# EAGLE design hacker-boards-refactor (EAGLE 7.3.0)
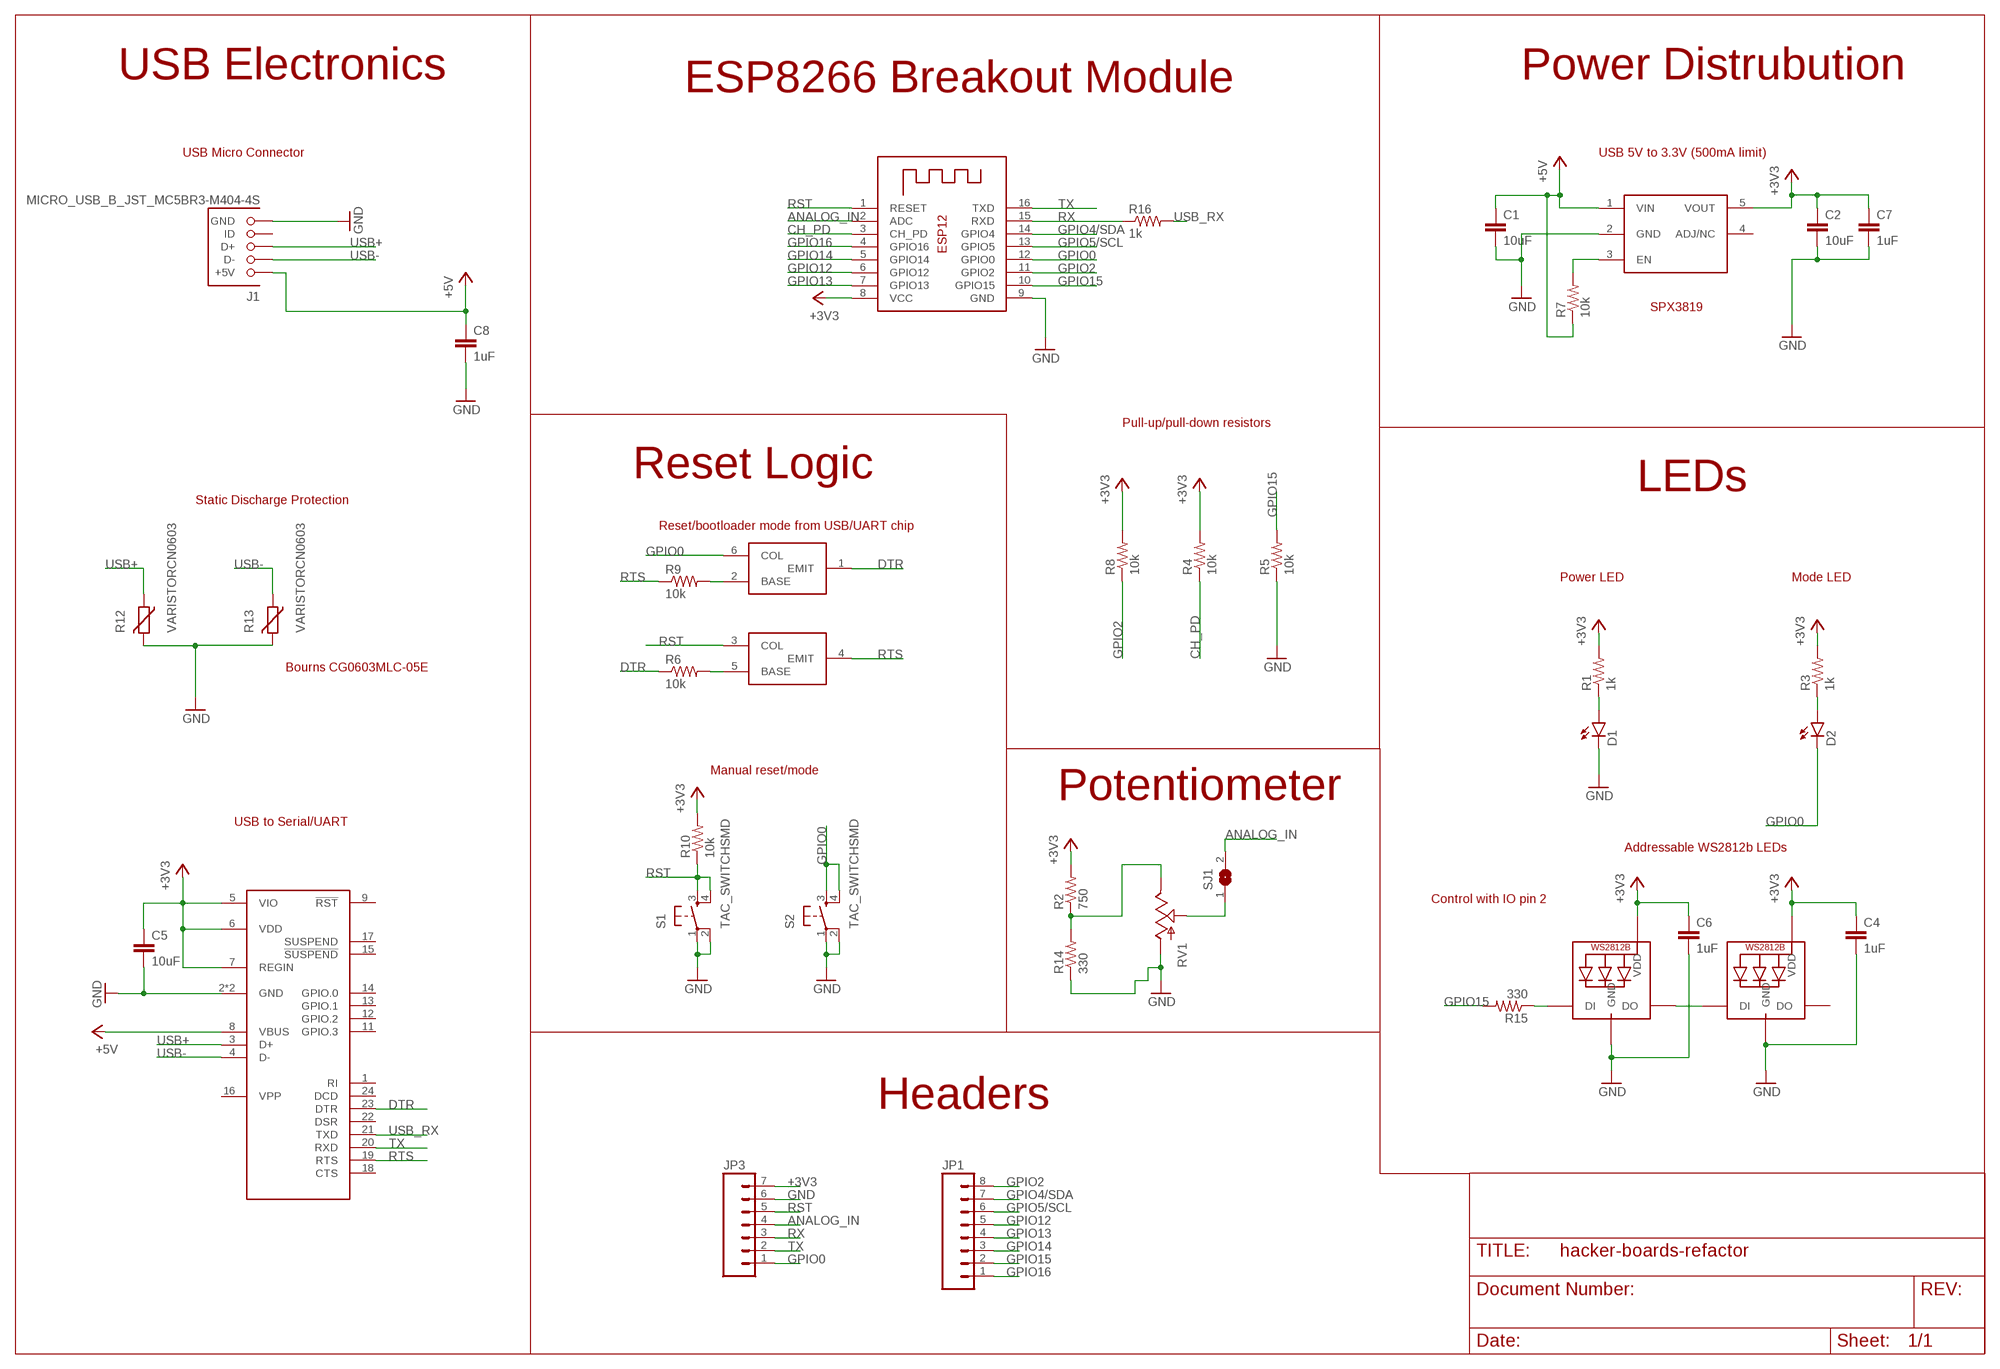
[diagram p0: schematic, sheet 1]

## Parts
C1  10uF  C0805  [C0805]
C2  10uF  C0805  [C0805]
C4  1uF  C-EUC0402  [C0402]
C5  10uF  C0805  [C0805]
C6  1uF  C-EUC0402  [C0402]
C7  1uF  C-EUC0402  [C0402]
C8  1uF  C-EUC0402  [C0402]
D1  LED0603  [LED-0603]
D2  LED0603  [LED-0603]
J1  MICRO_USB_B_JST_MC5BR3-M404-4S  [USB_MICRO_B-JST-MC5BR3-M404-4S-TB]
JP1  M08  [1X08_ROUND]
JP3  M07  [1X07]
LED1  WS2812B5050  [WS2812B]
LED2  WS2812B5050  [WS2812B]
R1  1k  R-US_R0402  [R0402]
R2  750  R-US_R0402  [R0402]
R3  1k  R-US_R0402  [R0402]
R4  10k  R-US_R0402  [R0402]
R5  10k  R-US_R0402  [R0402]
R6  10k  R-US_R0402  [R0402]
R7  10k  R-US_R0402  [R0402]
R8  10k  R-US_R0402  [R0402]
R9  10k  R-US_R0402  [R0402]
R10  10k  R-US_R0402  [R0402]
R12  VARISTORCN0603  [CT/CN0603]
R13  VARISTORCN0603  [CT/CN0603]
R14  330  R-US_R0402  [R0402]
R15  330  R-US_R0402  [R0402]
R16  1k  R-US_R0402  [R0402]
RV1  POTALPS-KIT  [ALPS_POT_KIT]
S1  TAC_SWITCHSMD  [TACTILE-SWITCH-SMD]
S2  TAC_SWITCHSMD  [TACTILE-SWITCH-SMD]
SJ1  SJ  [SJ]
U$2  AP2112  [SOT23-5L]
U$3  CP2104  [QFN24_4X4]
U$4  MBT3904DW1T1G  [SOT363]
X1  ESP-12  [ESP-12]

## Nets
+3V3: C2.1 C4.1 C5.1 C6.1 C7.1 JP3.7 LED1.1-VDD(VDD) LED2.1-VDD(VDD) R1.2 R2.2 R3.2 R4.2 R8.2 R10.2 U$2.5(VOUT) U$3.5(VIO) U$3.6(VDD) U$3.7(REGIN) X1.8(VCC)
+5V: C1.1 C8.1 J1.1(+5V) R7.1 U$2.1(VIN) U$3.8(VBUS)
ANALOG_IN: JP3.4 SJ1.2 X1.2(ADC)
CH_PD: R4.1 X1.3(CH_PD)
DTR: R6.1 U$3.23(DTR) U$4.1(EMIT)
GND: C1.2 C2.2 C4.2 C5.2 C6.2 C7.2 C8.2 D1.C J1.5(GND) JP3.6 LED1.3-GND(GND) LED2.3-GND(GND) R5.1 R12.2 R13.2 R14.1 RV1.P$3(A) S1.1 S1.2 S2.1 S2.2 U$2.2(GND) U$3.2(GND) U$3.25(GND) X1.9(GND)
GPIO0: D2.C JP3.1 S2.3 S2.4 U$4.6(COL) X1.12(GPIO0)
GPIO2: JP1.8 R8.1 X1.11(GPIO2)
GPIO4/SDA: JP1.7 X1.14(GPIO4)
GPIO5/SCL: JP1.6 X1.13(GPIO5)
GPIO12: JP1.5 X1.6(GPIO12)
GPIO13: JP1.4 X1.7(GPIO13)
GPIO14: JP1.3 X1.5(GPIO14)
GPIO15: JP1.2 R5.2 R15.2 X1.10(GPIO15)
GPIO16: JP1.1 X1.4(GPIO16)
N$1: D1.A R1.1
N$3: D2.A R3.1
N$4: R2.1 R14.2 RV1.P$1(E)
N$5: LED1.2-DOUT(DO) LED2.4-DIN(DI)
N$6: LED1.4-DIN(DI) R15.1
N$7: R7.2 U$2.3(EN)
N$8: R9.2 U$4.2(BASE)
N$11: R6.2 U$4.5(BASE)
N$12: RV1.P$2(S) SJ1.1
RST: JP3.5 R10.1 S1.3 S1.4 U$4.3(COL) X1.1(RESET)
RTS: R9.1 U$3.19(RTS) U$4.4(EMIT)
RX: JP3.3 R16.1 X1.15(RXD)
TX: JP3.2 U$3.20(RXD) X1.16(TXD)
USB+: J1.3(D+) R12.1 U$3.3(D+)
USB-: J1.2(D-) R13.1 U$3.4(D-)
USB_RX: R16.2 U$3.21(TXD)
Unconnected: J1.4(ID) LED2.2-DOUT(DO) U$2.4(ADJ/NC) U$3.1(RI) U$3.9(!RST) U$3.11(GPIO.3) U$3.12(GPIO.2) U$3.13(GPIO.1) U$3.14(GPIO.0) U$3.15(!SUSPEND) U$3.16(VPP) U$3.17(SUSPEND) U$3.18(CTS) U$3.22(DSR) U$3.24(DCD)

## Notes on the sheet
- USB Electronics | Power Distrubution
- ESP8266 Breakout Module
- USB Micro Connector | USB 5V to 3.3V (500mA limit)
- SPX3819
- Pull-up/pull-down resistors
- Reset Logic
- LEDs
- Static Discharge Protection
- Reset/bootloader mode from USB/UART chip
- Power LED | Mode LED
- Bourns CG0603MLC-05E
- Manual reset/mode
- Potentiometer
- USB to Serial/UART
- Addressable WS2812b LEDs
- Control with IO pin 2
- Headers

## Library data of the parts
C1 C2 C5 = hacker-board:C
C4 C6-C8 = resistor:C-EU: CAPACITOR, European symbol
D1 D2 = hacker-board:LED: LEDs Standard schematic elements and footprints for 5mm, 3mm, 1206, and 0603 sized LEDs. 5mm - Spark Fun Electronics SKU : COM-00529 (and others)
J1 = hacker-board:MICRO_USB_B_JST_MC5BR3-M404-4S: Micro USB B mid mount; DIGIKEY: 455-2567-2-ND; MOUSER: 53X3655
JP1 = SparkFun-Connectors:M08: Header 8 Standard 8-pin 0.1" header. Use with straight break away headers (SKU : PRT-00116), right angle break away headers (PRT-00553), swiss pins (PRT-00743), machine pins (PRT-00117), and female headers (PRT-00115).; PROD_ID: CONN-08437
JP3 = SparkFun-Connectors:M07: Header 7 Standard 7-pin 0.1" header. Use with straight break away headers (SKU : PRT-00116), right angle break away headers (PRT-00553), swiss pins (PRT-00743), machine pins (PRT-00117), and female headers (PRT-00115). NOTES ON THE VARIANTS LOCK and LOCK_LONGPADS... This footprint was designed to help hold the alignment of a through-hole component (i.e. 7-pin header) while soldering it into place. You may notice that each hole has been shifted either up or down by 0.005 of an inch from it's more standard position (which is usually a perfectly straight line). This slight alteration caused the pins (the squares in the middle) to touch the edges of the holes. Because they are alternating, it causes a "brace" to hold the header in place. 0.005 has proven to be the perfect amount of "off-center" position when using our standard breakaway headers. Although looks a little odd when you look at the bare footprint, once you have a header in there, the alteration is very hard to notice. Also, if you push a header all the way into place, it is covered up entirely on the bottom side. This idea of altering the position of holes to aid alignment will be further integrated into the Sparkfun Library for other footprints. It can help hold any component with 3 or more connection pins.
LED1 LED2 = hacker-board:WS2812B
R1-R10 R14-R16 = resistor:R-US_: RESISTOR, American symbol
R12 R13 = varistor:VARISTOR: VARISTOR
RV1 = SparkFun-Electromechanical:POT; PROD_ID: RES-09177
S1 S2 = hacker-board:TAC_SWITCH: Momentary Switch Button commonly used for reset or general input. Spark Fun Electronics SKU : COM-00097 SMT- SWCH-08247; PROD_ID: SWCH-08247
SJ1 = jumper:SJ: SMD solder JUMPER
U$2 = hacker-board:AP2112
U$3 = hacker-board:CP2104
U$4 = hacker-board:MBT3904DW1T1G
X1 = hacker-board:ESP-12

## Net classes
0 default: width 0.203 mm, drill 0.406 mm

## Board
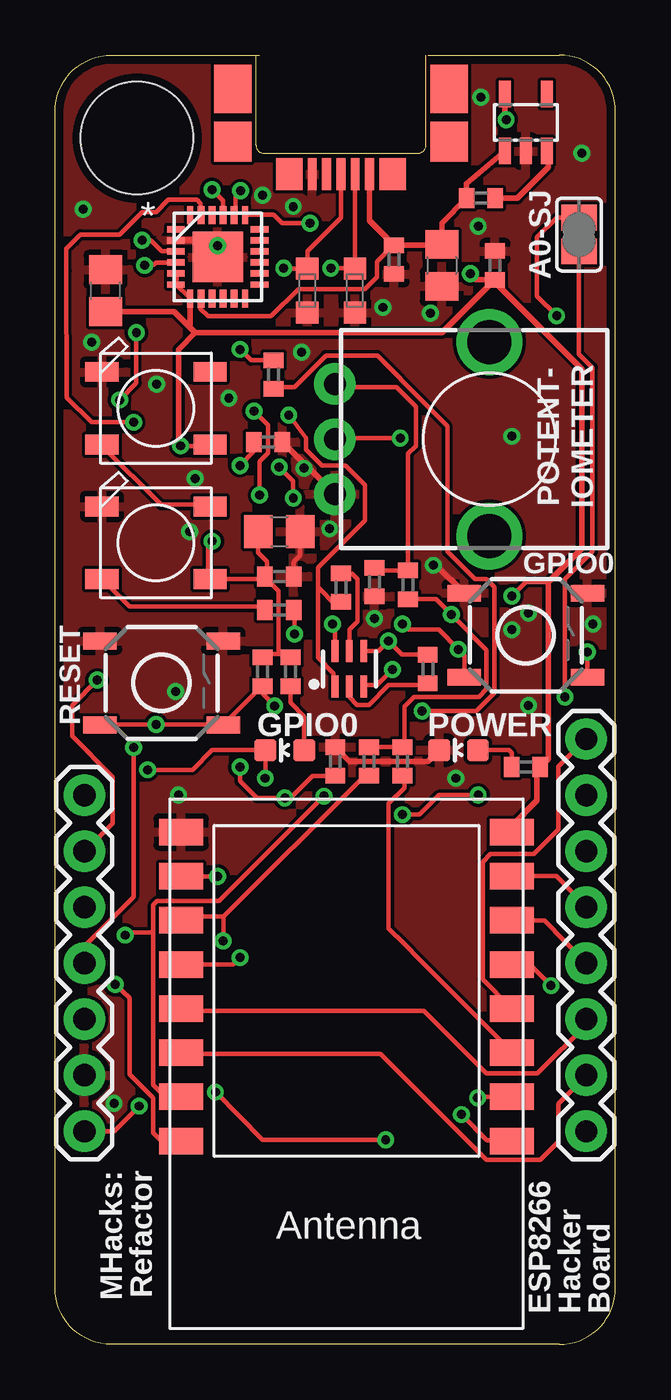
[diagram p1: board, top side]
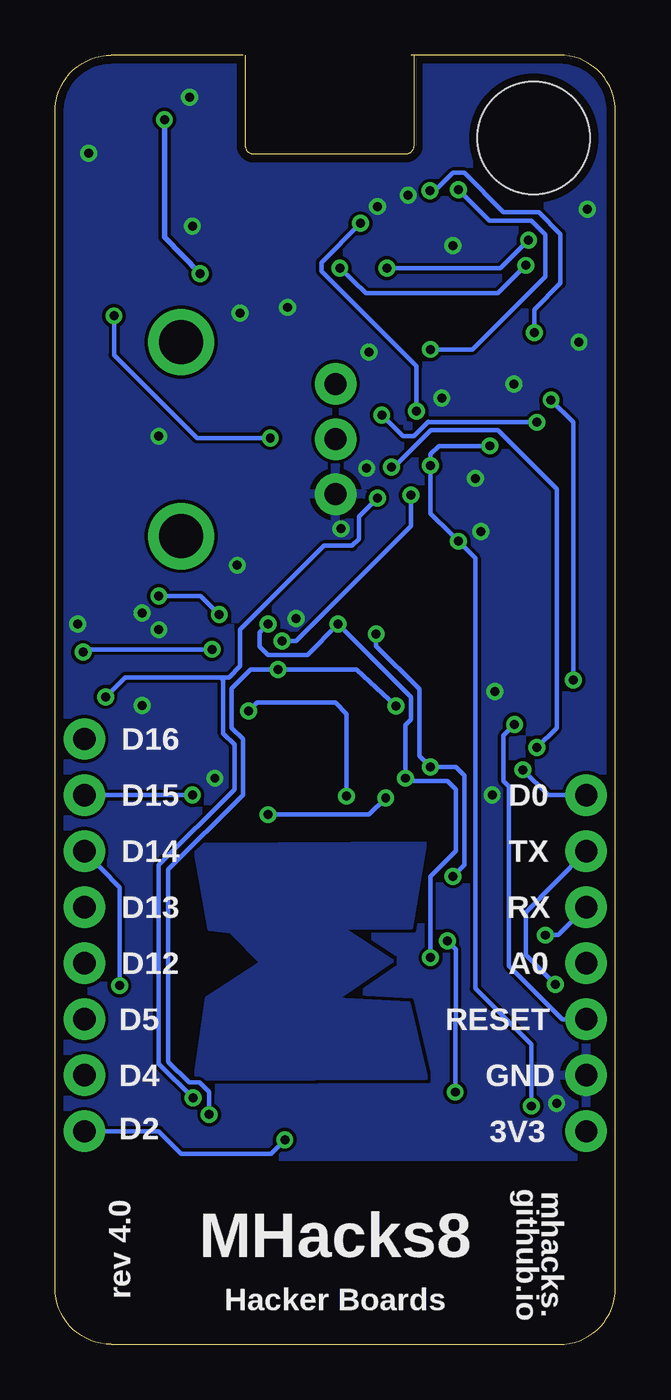
[diagram p2: board, bottom side, seen from below]

Size 25.4 x 58.42 mm. Coordinates in mm from the lower left corner, seen from the top.
Outline: 9.27,58.42 2.54,58.42 arc90 0,55.88 0,2.54 arc90 2.54,0 22.86,0 arc90 25.4,2.54 25.4,55.88 arc90 22.86,58.42 16.89,58.42
Copper layers (1*16): Top 0.0356mm / dielectric 1.5011mm / Bottom 0.0356mm
Design rules "LaenPCBOrder": minimum track width 6mil, minimum drill 13mil, track to track 6mil, track to pad 6mil, pad to pad 6mil, via to via 6mil, smd to smd 6mil, copper to edge 15mil, drill to drill 6mil, minimum pad ring 7mil, minimum via ring 7mil, stop-mask expansion 3mil, vias tented up to drill 0mil, thermal gap 10mil
Holes 5.08 mm at 3.71,54.66

### Footprints (pad centres in the part's own frame; a part is rotated, then mirrored left to right if it is on the bottom)
C0805 = smd 1.3 x 1.5: 1 -0.95,0; 2 0.95,0
C0402 = smd 0.7 x 0.9: 1 -0.65,0; 2 0.65,0
LED-0603 = smd 1 x 1: A 0,-0.877; C 0,0.877
USB_MICRO_B-JST-MC5BR3-M404-4S-TB = smd 0.4 x 1.45: 1 -1.3,3.875; 2 -0.65,3.875; 3 0,3.875; 4 0.65,3.875; 5 1.3,3.875 | smd 1.7 x 2.2: P$1 -4.9,0; P$2 4.9,0 | smd 1.7 x 1.8: P$3 -4.9,2.4; P$4 4.9,2.4 | smd 1.2 x 1.45: P$5 -2.35,3.875; P$6 2.35,3.875
1X08_ROUND = drill 1.016 pad 1.88: 1 0,0; 2 2.54,0; 3 5.08,0; 4 7.62,0; 5 10.16,0; 6 12.7,0; 7 15.24,0; 8 17.78,0
1X07 = drill 1.016 pad 1.88: 1 0,0; 2 2.54,0; 3 5.08,0; 4 7.62,0; 5 10.16,0; 6 12.7,0; 7 15.24,0
WS2812B = smd 1.5 x 0.9: 1-VDD 2.45,-1.65; 2-DOUT 2.45,1.65; 3-GND -2.45,1.65; 4-DIN -2.45,-1.65
R0402 = smd 0.7 x 0.9: 1 -0.65,0; 2 0.65,0
CT/CN0603 = smd 1 x 1: 1 -1,0; 2 1,0
ALPS_POT_KIT = drill 1 pad 1.88: P$1 7,-2.5; P$2 7,0; P$3 7,2.5 | drill 2: P$4 0,-4.4; P$5 0,4.4
TACTILE-SWITCH-SMD = smd 1.524 x 0.762: 1 -2.794,1.905; 2 2.794,1.905; 3 -2.794,-1.905; 4 2.794,-1.905
SJ = smd 1.168 x 1.6: 1 -0.762,0; 2 0.762,0
SOT23-5L = smd 0.55 x 1.2: 1 -0.95,-1.3; 2 0,-1.3; 3 0.95,-1.3; 4 0.95,1.3; 5 -0.95,1.3
QFN24_4X4 = smd 0.813 x 0.279: 1 -1.892,1.25; 6 -1.892,-1.25; 13 1.892,-1.25; 18 1.892,1.25 | smd 0.813 x 0.305: 2 -1.892,0.75; 3 -1.892,0.25; 4 -1.892,-0.25; 5 -1.892,-0.75; 14 1.892,-0.75; 15 1.892,-0.25; 16 1.892,0.25; 17 1.892,0.75 | smd 0.279 x 0.813: 7 -1.25,-1.892; 12 1.25,-1.892; 19 1.25,1.892; 24 -1.25,1.892 | smd 0.305 x 0.813: 8 -0.75,-1.892; 9 -0.25,-1.892; 10 0.25,-1.892; 11 0.75,-1.892; 20 0.75,1.892; 21 0.25,1.892; 22 -0.25,1.892; 23 -0.75,1.892 | smd 2.286 x 2.286: 25 0,0
SOT363 = smd 0.3 x 0.99: 1 -0.65,-0.8; 2 0,-0.8; 3 0.65,-0.8; 4 0.65,0.81; 5 0,0.81; 6 -0.65,0.81
ESP-12 = smd 2 x 1.2: 1 -7.5,4.5; 2 -7.5,2.5; 3 -7.5,0.5; 4 -7.5,-1.5; 5 -7.5,-3.5; 6 -7.5,-5.5; 7 -7.5,-7.5; 8 -7.5,-9.5; 9 7.5,-9.5; 10 7.5,-7.5; 11 7.5,-5.5; 12 7.5,-3.5; 13 7.5,-1.5; 14 7.5,0.5; 15 7.5,2.5; 16 7.5,4.5

### Placement (x,y rotation side)
C1  17.53,48.9 270 top
C2  10.16,36.83 0 top
C4  9.65,40.89 0 top
C5  2.29,47.75 90 top
C6  10.16,34.8 0 top
C7  19.94,48.9 90 top
C8  15.37,49.15 270 top
D1  18.29,26.92 90 top
D2  10.41,26.92 90 top
J1  12.95,56.9 180 top
JP1  24.08,27.43 270 top
JP3  1.32,24.89 270 top
LED1  4.57,36.32 0 top
LED2  4.57,42.42 0 top
R1  21.34,26.16 0 top
R2  16,34.42 270 top
R3  10.67,30.48 90 top
R4  15.75,26.42 90 top
R5  12.7,26.42 270 top
R6  12.95,34.29 90 top
R7  19.3,51.94 0 top
R8  14.22,26.42 90 top
R9  16.89,30.61 270 top
R10  9.4,30.48 90 top
R12  11.43,47.75 270 top
R13  13.59,47.75 270 top
R14  14.48,34.54 90 top
R15  10.16,33.27 0 top
R16  9.91,43.94 90 top
RV1  19.68,41.02 180 top
S1  4.83,29.97 0 top
S2  21.34,32.13 0 top
SJ1  23.75,50.29 270 top
U$1  [LOGO8EDGY]  8.69,12.09 90 bottom
U$2  21.34,55.37 0 top
U$3  7.37,49.28 0 top
U$4  13.34,30.61 0 top
X1  13.21,13.72 180 top

### Tracks (layer width: path | path; a pad name or v marks a point on that pad's centre or on a via)
+3V3  (via drill 0.41, 0.41 pad 0.41)
  Top 0.203: 5.51,48.01 5.51,48.54 U$3.5 | 5.51,48.01 6.04,47.47 U$3.7 | 5.51,48.01 U$3.6 | R4.2 15.82,27.2 15.82,28.91 16.26,29.34 19.2,29.34 19.56,29.69 19.56,31.47 v17.96,33.07 17.26,33.77 R2.2 | 20.62,23.47 X1.8 | 15.82,27.03 R4.2 | 10.13,31.29 10.67,31.29 R3.2 | 10.13,31.29 9.42,31.29 R10.2 | 9.07,40.89 C4.1 9,40.45 v8.38,39.83 | C6.1 9.6,34.85 9.6,35.48 9.21,35.88 C2.1 | 10.13,31.29 10.13,34.14 9.6,34.67 C6.1 | C6.1 9.42,34.67 7.11,34.67 LED1.1-VDD 6.93,34.85 6.93,36.21 v7.12,36.39 | v5.69,40.72 6.93,40.72 LED2.1-VDD | R8.2 R4.2 | 22.35,34.54 21.34,34.54 v20.7,33.91 | JP3.7 2.67,9.65 v3.81,10.79
  Top 0.254: C7.1 19.94,48.13 23.88,44.2 23.88,36.07 22.35,34.54 22.35,26.53 R1.2 21.84,26.02 21.84,24.64 20.71,23.5 X1.8 | 6.35,45.85 17.54,45.85 C7.1 | 6.12,46.08 U$3.7 | 6.35,45.85 5.59,45.09 5.59,40.82 v5.69,40.72 | 6.12,46.08 6.35,45.85 | U$2.5 20.39,55.69 v20.45,55.5 | v18.82,48.51 19.07,48.24 C7.1 | C5.1 5.39,46.8 6.12,46.08
  Bottom 0.203: v5.69,40.72 8,40.72 8.38,40.34 v8.38,39.83 8.38,37.66 7.51,36.79 v7.12,36.39 6.35,35.63 6.35,16.13 3.81,13.59 v3.81,10.79 | v20.7,33.91 18.8,33.91 v17.96,33.07
  Bottom 0.254: v20.45,55.5 20.45,50.16 v18.82,48.51
+5V
  Top 0.203: U$3.8 6.58,47.3 6.58,46.94 6.93,46.58 9.78,46.58 11.02,47.83 14.05,47.83 14.58,48.36 14.58,49.07 15.29,49.78 C8.1
  Top 0.254: U$2.1 18.65,52.59 R7.1 17.53,50.81 C1.1 17.48,49.8 C8.1 14.25,50.91 J1.1
ANALOG_IN  (via drill 0.41, 0.41 pad 0.41)
  Top 0.203: v23.11,29.34 23.11,34.67 24.36,35.92 24.36,44.27 23.75,44.88 SJ1.2 | v3.56,27.05 3.56,20.27 1.42,18.14 1.42,17.42 JP3.4 | v10.79,38.35 10.79,39.12 v10.16,39.75 | X1.2 19.14,11.22 v19.15,11.18
  Bottom 0.203: v10.79,38.35 11.63,37.52 11.63,36.5 11.94,36.2 13.21,36.2 17.02,32.38 17.02,30.73 17.53,30.23 17.91,30.23 | v10.16,39.75 10.03,39.75 8.36,41.43 5.33,41.43 2.67,38.76 2.67,27.94 v3.56,27.05 | v23.11,29.34 22.23,30.23 17.91,30.23 | 17.91,30.23 17.78,30.1 17.78,27.69 17.27,27.18 17.27,25.15 20.7,21.72 20.7,12.7 v19.15,11.18
CH_PD
  Top 0.203: R4.1 15.82,25.6 15.82,25.22 15.11,24.51 15.11,18.85 15.82,18.14 16.54,17.42 20.62,13.34 X1.3
DTR  (via drill 0.41, 0.41 pad 0.41)
  Top 0.203: v10.59,42.11 11.38,41.07 11.38,40.54 12.09,39.83 13.16,39.83 14.05,38.94 14.05,37.34 11.91,35.2 11.91,34.31 | 6.58,51.21 U$3.23 6.6,51.18 6.6,51.69 6.43,51.87 5.13,51.87 4.57,51.31 3.94,51.31 2.92,50.29 1.14,50.29 0.51,49.66 0.51,48.64 0.53,42.9 1.65,41.78 v3.56,41.78 | U$4.1 12.62,29.87 12.62,30.4 11.91,31.11 11.91,34.31 | 11.91,34.31 12.71,33.51 R6.1
  Bottom 0.203: v10.59,42.11 9.63,41.15 9.14,41.15 8.48,41.81 8.46,41.78 v3.56,41.78
GND  (via drill 0.41, 0.41 pad 0.41)
  Top 0.203: C6.2 10.81,35.45 11.11,35.75 C2.2 | v17.14,35.31 17.27,35.31 | D1.C 17.41,26.66
  Top 0.254: R5.1 13.35,26.42 16.9,26.42 D1.C
  Top 0.305: U$3.2 6.62,50.03 U$3.25 | 17.27,35.31 S2.1 | C4.2 10.31,40.89 RV1.P$3
  other vias: 19.3,56.52 19.18,50.67 21.46,28.96 24.38,32.64 14.86,46.99 17.02,46.74 9.4,52.07 10.79,51.56 7.37,49.78 5.46,29.59 18.16,25.65 12.45,36.96 1.27,51.44 4.6,43.51 6.1,36.83 20.7,41.15 7.87,42.88 14.48,32.89 2.67,10.92 5.59,24.89 21.46,33.15 23.88,53.98 20.7,32.38 6.35,39.24 11.18,44.96 11.28,39.7 1.65,45.42
  pour Top: -0.25,58.55 25.53,58.55 25.53,8.51 -0.25,8.51
  pour Bottom (rank 2): -0.25,58.55 25.53,58.55 25.53,8.51 -0.25,8.51
GPIO0  (via drill 0.41, 0.41 pad 0.41)
  Top 0.203: 9.42,26.67 D2.C | D2.C 7.11,26.92 6.22,26.04 v4.19,26.04 | D2.C 9.54,25.67 v9.53,25.65 | v12.57,32.64 12.69,32.53 U$4.6 | S2.3 18.54,31.24 v18.29,31.5 17.4,32.38 16,32.38 v15.75,32.64 | v24.13,31.37 S2.4 | X1.12 8.07,17.22 v8.38,17.53
  Bottom 0.203: 1.42,24.89 JP3.1 3.05,24.89 v4.19,26.04 | v18.29,31.5 24,31.5 v24.13,31.37 | v15.75,32.64 16.13,32.26 16.13,31.62 15.75,31.24 13.97,31.24 v12.57,32.64 9.27,29.34 9.27,28.32 9.53,28.07 v9.53,25.65 9.4,25.53 7.62,25.53 7.24,25.15 7.24,22.35 8.38,21.21 v8.38,17.53
GPIO2  (via drill 0.41)
  Top 0.203: 7.64,19.38 13.87,25.6 14.22,25.6 R8.1 | 7.64,19.38 5.87,19.38 X1.11 | 7.64,19.38 7.64,18.26 v7.62,18.29 | v14.99,9.27 9.4,9.27 v7.26,11.43
  Bottom 0.203: JP1.8 20.7,9.65 19.68,8.64 15.62,8.64 v14.99,9.27 | v7.26,11.43 7.24,17.91 v7.62,18.29
GPIO4/SDA
  Top 0.203: X1.14 5.87,13.16 14.76,13.16 19.56,8.36 22,8.36 22.81,9.17 22.81,10.9 24,12.09 JP1.7
GPIO5/SCL
  Top 0.203: X1.13 5.87,15.11 16.71,15.11 19.56,12.27 21.87,12.27 24.13,14.53 JP1.6
GPIO12
  Top 0.203: 20.8,19.38 X1.6 22.19,19.22 JP1.5
GPIO13
  Top 0.203: X1.7 22.73,21.22 JP1.4
GPIO14  (via drill 0.41 pad 0.41)
  Top 0.203: X1.5 20.8,17.25 21.49,17.25 v22.48,16.26
  Bottom 0.203: v22.48,16.26 22.48,20.7 JP1.3
GPIO15  (via drill 0.41, 0.41 pad 0.41)
  Top 0.203: X1.10 5.87,21.34 5.99,21.21 v7.37,21.21 | v10.85,32.18 10.85,33.25 R15.2 | R5.2 11.67,25.77 10.67,24.77 v10.41,24.77 9.14,24.77 8.38,25.53 v8.38,26.16 | v19.18,24.89 17.4,24.89 16.51,24 v15.75,24
  Bottom 0.203: v10.85,32.18 10.85,31.65 8.89,29.69 8.89,26.67 v8.38,26.16 7.24,26.16 6.86,25.78 6.86,21.72 v7.37,21.21 | JP1.2 v19.18,24.89 | v10.41,24.77 11.18,24 v15.75,24
GPIO16
  Top 0.203: X1.4 20.62,15.29 19.38,16.54 19.38,21.87 19.74,22.23 21.69,22.23 22.81,23.34 22.81,26.19 24,27.38 JP1.1
N$1
  Top 0.203: 20.62,26.14 R1.1 20.7,26.18 20.7,26.8 20.57,26.92 D1.A
N$2
  pour Bottom: 8.66,22.71 18.62,22.63 19,22.28 18.39,18.82 17.42,18.72 16.05,17.3 18.52,15.7 19,12.24 18.62,12.04 8.59,12.06 9.37,15.44 12.67,15.62 10.13,17.37 12.45,18.9 9.27,18.9 8.64,22.71
N$3
  Top 0.203: D2.A 11.29,28.46 10.67,29.08 R3.1
N$4
  Top 0.203: R2.1 16,40.36 16.36,40.72 16.36,42.49 15.47,43.38 12.8,43.38 RV1.P$1 | 16,34.85 R2.1 | R14.2 14.61,35.07 R2.1
N$5
  Top 0.203: LED1.2-DOUT 6.93,38.05 4.8,38.05 2.13,40.72 LED2.4-DIN
N$6
  Top 0.203: R15.1 9.42,33.43 3.38,33.43 2.13,34.67 LED1.4-DIN
N$7
  Top 0.254: R7.2 20.95,51.94 22.35,53.34 22.35,54.26 U$2.3
N$8
  Top 0.203: U$4.2 13.34,29.34 13.69,28.98 14.22,28.98 15.11,29.87 16.89,29.87 R9.2
N$11
  Top 0.203: 12.8,34.67 R6.2 13.45,34.94 13.72,34.67 13.72,32.77 13.34,32.38 U$4.5
N$12  (via drill 0.41)
  Top 0.203: v15.65,41.07 12.8,41.07 RV1.P$2 | v22.73,46.61 21.84,47.5 21.84,50.16 22.73,51.05 SJ1.1
  Bottom 0.203: v15.65,41.07 18.97,41.07 22.73,44.83 v22.73,46.61
RST  (via drill 0.41, 0.41 pad 0.41)
  Top 0.203: v15.29,30.58 14.58,29.87 14.05,29.87 U$4.3 | S1.3 2.13,28.09 v4.57,28.09 7.47,28.09 S1.4 9.25,29.69 R10.1 9.4,29.49 v9.96,28.93 | X1.1 20.62,9.25 19.58,9.25 v18.41,10.41
  Bottom 0.203: v9.96,28.93 11.73,30.58 v15.29,30.58 16.54,30.58 17.4,29.72 17.4,27.94 16.89,27.43 16.89,24.89 20.27,21.51 20.27,12.8 19.33,11.86 18.85,11.86 18.41,11.43 v18.41,10.41 | JP3.5 2.41,14.73 4.83,17.14 4.83,25.27 5.08,25.53 5.08,27.58 v4.57,28.09
RTS  (via drill 0.41 pad 0.41)
  Top 0.203: U$4.4 14.65,31.42 v15.11,31.88 15.73,31.26 R9.1 | v9.27,38.48 9.27,40.01 9.65,40.39 9.65,41.66 v9.02,42.29 | v11.56,50.8 10.29,50.8 9.91,51.18 U$3.19
  Bottom 0.203: v15.11,31.88 14.48,31.88 9.27,37.08 v9.27,38.48 | v9.02,42.29 9.02,44.32 13.34,48.64 13.34,49.02 v11.56,50.8
RX  (via drill 0.41, 0.41 pad 0.41)
  Top 0.203: 4.45,18.67 4.45,11.76 5,11.2 5.69,11.2 X1.15 5.69,11.2 | 4.45,18.67 4.45,19.91 4.62,20.09 7.44,20.09 v12.19,24.84 | R16.1 9.96,43.38 10.85,43.38 12.27,44.81 14.61,44.81 15.67,43.74 15.65,43.74 17.78,41.6 17.78,35.92 19.02,34.67 19.56,34.67 19.91,34.31 19.91,29.52 19.1,28.7 v16.64,28.7 | v3.17,18.54 3.3,18.67 4.45,18.67
  Bottom 0.203: v12.19,24.84 12.19,28.57 12.7,29.08 16.26,29.08 v16.64,28.7 | JP3.3 2.59,18.54 v3.17,18.54
TX  (via drill 0.41)
  Top 0.203: v8.41,52.27 8.18,52.05 8.18,51.21 U$3.20 | JP3.2 1.42,22.4 2.62,23.6 2.62,25.7 0.76,27.56 0.76,28.96 v1.91,30.1 | v2.72,16.31 3.38,15.7 3.38,12.24 4.45,11.18 4.45,9.58 4.8,9.22 X1.16 5.69,9.25 | v3.68,45.85 3.68,43.56 v2.92,42.8
  Bottom 0.203: JP3.2 2.74,20.9 4.06,19.58 4.06,17.65 v2.72,16.31 | v8.41,52.27 8.18,52.27 7.37,53.09 6.86,53.09 5.08,51.31 3.48,51.31 2.49,50.32 2.49,48.08 3.68,46.89 v3.68,45.85 | v1.91,30.1 1.91,41.78 v2.92,42.8
USB+  (via drill 0.41)
  Top 0.203: J1.3 12.95,51.05 11.43,49.53 R12.1 10.68,48.75 v10.36,48.77 | v3.94,50.04 4.32,50.04 4.83,49.53 U$3.3
  Bottom 0.203: v10.36,48.77 5.21,48.77 v3.94,50.04
USB-  (via drill 0.41)
  Top 0.203: v4.06,48.9 4.45,48.9 4.57,49.02 U$3.4 | v12.5,48.77 13.57,48.77 R13.1 13.59,53.01 J1.2
  Bottom 0.203: v4.06,48.9 5.33,47.62 11.3,47.62 v12.5,48.77
USB_RX  (via drill 0.41 pad 0.41)
  Top 0.203: U$3.21 7.62,51.82 v7.11,52.32 | R16.2 8.88,44.59 v8.38,45.09
  Bottom 0.203: v8.38,45.09 6.48,45.09 3.17,48.39 3.17,50.29 3.81,50.93 5.71,50.93 v7.11,52.32

### Text on the board
tNames: A0-SJ | POTENT- / IOMETER | GPIO0 | RESET | GPIO0 | POWER | MHacks: / Refactor | ESP8266 / Hacker / Board
bNames: D16 | D0 | D15 | TX | D14 | RX | D13 | A0 | D12 | RESET | D5 | GND | D4 | 3V3 | D2 | MHacks8 | mhacks. / github.io | rev 4.0 | Hacker Boards
tValues: POT-SJ